# Altium schematic sheet PORT_EX.SchDoc
size A
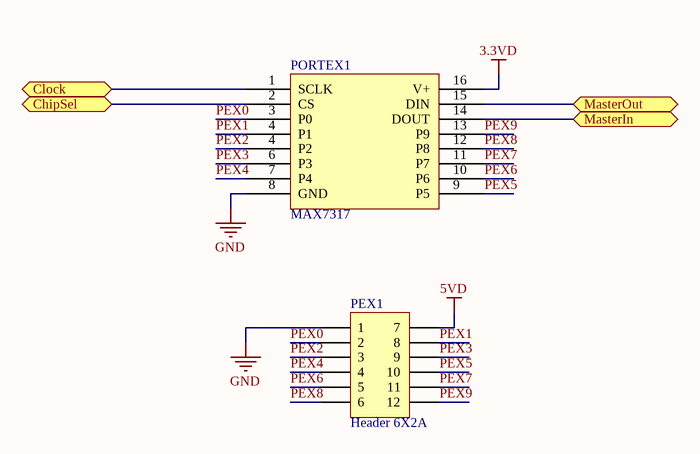
[diagram p0: PORT_EX.SchDoc]

## Parts
PEX1  Header 6X2A  [HDR2X6_CEN]
PORTEX1  MAX7317  [MAX7317]

## Ports
ChipSel, Clock, MasterIn, MasterOut

## Nets
3.3VD: PORTEX1.16(V+)
5VD: PEX1.7
GND: PEX1.1 PORTEX1.8(GND)
ChipSel: PORTEX1.2(CS) ; port ChipSel
Clock: PORTEX1.1(SCLK) ; port Clock
MasterIn: PORTEX1.14(DOUT) ; port MasterIn
MasterOut: PORTEX1.15(DIN) ; port MasterOut
PEX0: PEX1.2 PORTEX1.3(P0)
PEX1: PEX1.8 PORTEX1.4(P1)
PEX2: PEX1.3 PORTEX1.4(P2)
PEX3: PEX1.9 PORTEX1.6(P3)
PEX4: PEX1.4 PORTEX1.7(P4)
PEX5: PEX1.10 PORTEX1.9(P5)
PEX6: PEX1.5 PORTEX1.10(P6)
PEX7: PEX1.11 PORTEX1.11(P7)
PEX8: PEX1.6 PORTEX1.12(P8)
PEX9: PEX1.12 PORTEX1.13(P9)

## Library data of the parts
PEX1 = Header 6X2A: Header, 6-Pin, Dual row; LatestRevisionDate: 17-Jul-2002; LatestRevisionNote: Re-released for DXP Platform.; Publisher: Altium Limited
PORTEX1 = MAX7317: URL: http://www.digikey.com/product-detail/en/MAX7317AEE%2B/MAX7317AEE%2B-ND/1780041; DATA: http://datasheets.maximintegrated.com/en/ds/MAX7317.pdf